# EAGLE design Compressor (EAGLE 8.2.2)
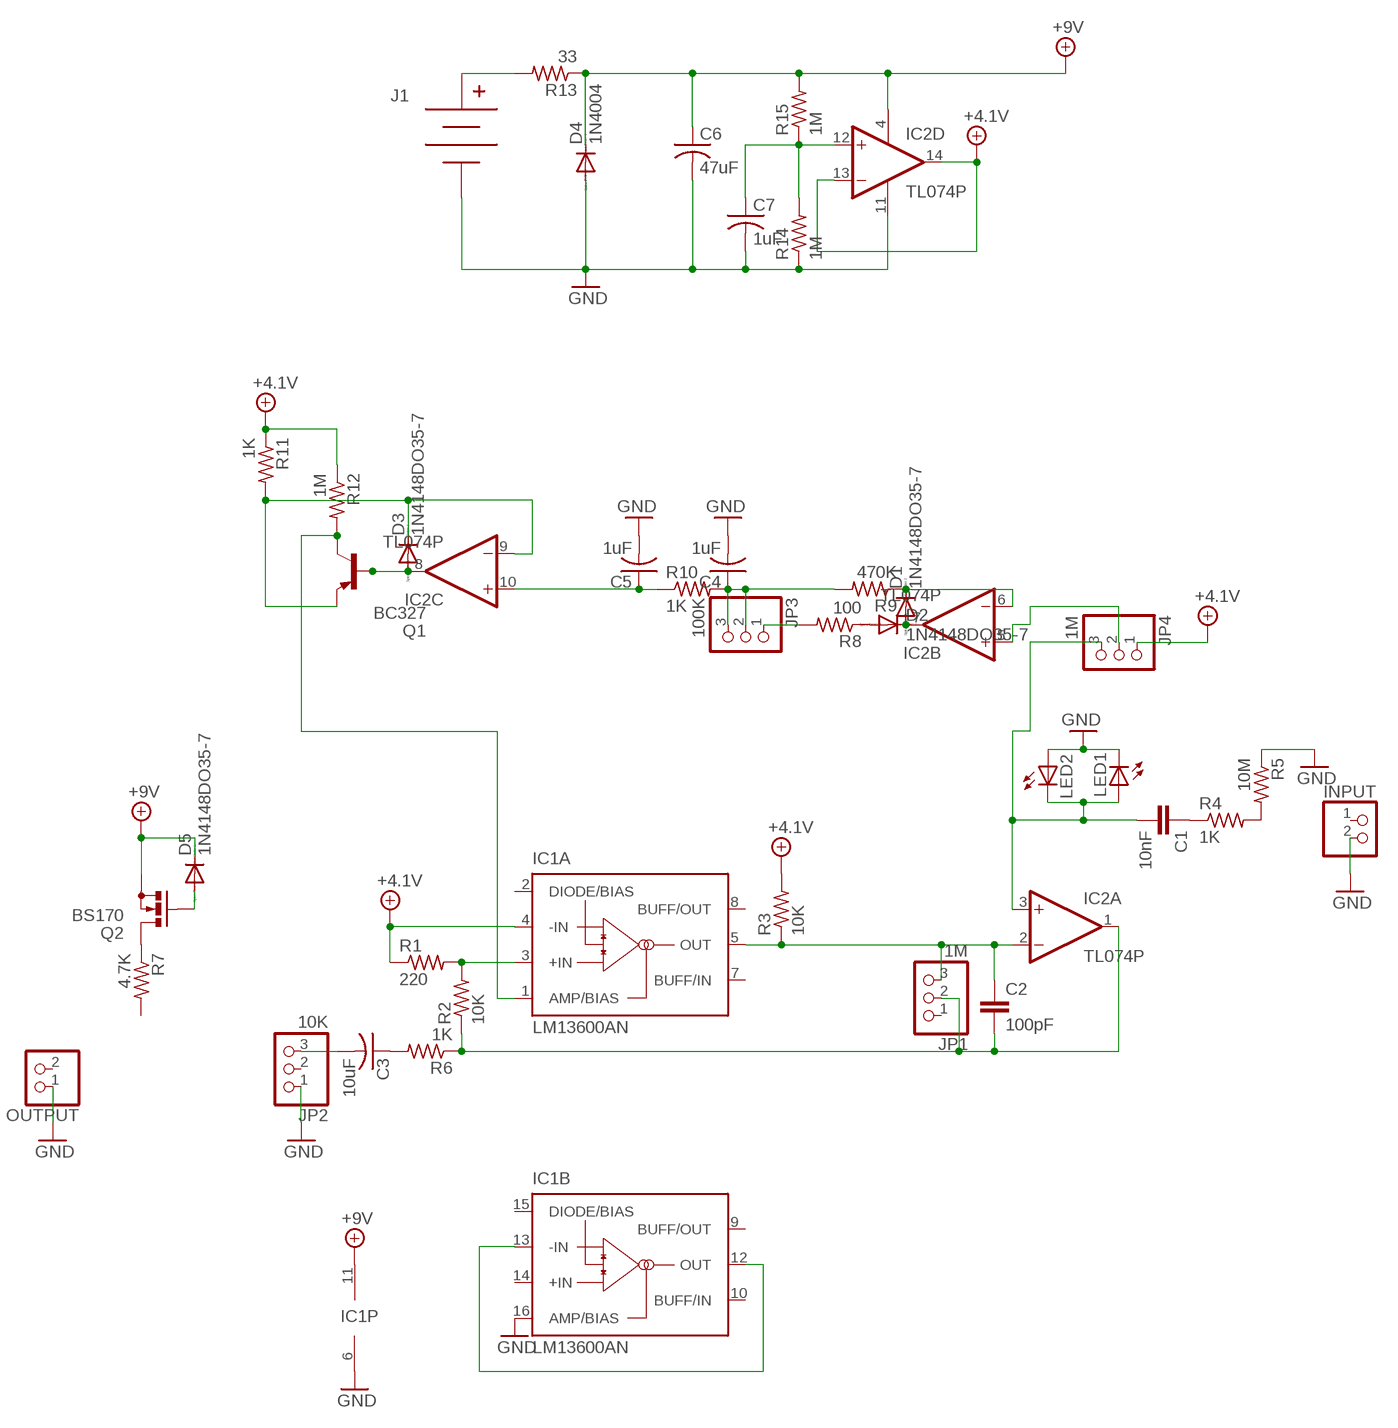
[diagram p0: schematic, sheet 1]

## Parts
C1  10nF  C-EU025-030X050  [C025-030X050]
C2  100pF  C-EU025-030X050  [C025-030X050]
C3  10uF  C-US025-040X050  [C025-040X050]
C4  1uF  C-US025-040X050  [C025-040X050]
C5  1uF  C-US025-040X050  [C025-040X050]
C6  47uF  C-US025-040X050  [C025-040X050]
C7  1uF  C-US025-040X050  [C025-040X050]
D1  1N4148DO35-7  [DO35-7]
D2  1N4148DO35-7  [DO35-7]
D3  1N4148DO35-7  [DO35-7]
D4  1N4004  [DO41-10]
D5  1N4148DO35-7  [DO35-7]
IC1  LM13600AN  [DIL16]
IC2  TL074P  [DIL14]
INPUT  PINHD-1X2  [1X02]
J1  BC9VPC  [BC9VPC]
JP1  1M  PINHD-1X3  [1X03]
JP2  10K  PINHD-1X3  [1X03]
JP3  100K  PINHD-1X3  [1X03]
JP4  1M  PINHD-1X3  [1X03]
LED1  LEDLZR181  [LZR181]
LED2  LEDLZR181  [LZR181]
OUTPUT  PINHD-1X2  [1X02]
Q1  BC327  [TO92]
Q2  BS170  [SOT54E]
R1  220  R-US_0207/7  [0207/7]
R2  10K  R-US_0207/7  [0207/7]
R3  10K  R-US_0207/7  [0207/7]
R4  1K  R-US_0207/7  [0207/7]
R5  10M  R-US_0207/7  [0207/7]
R6  1K  R-US_0207/7  [0207/7]
R7  4.7K  R-US_0207/7  [0207/7]
R8  100  R-US_0207/7  [0207/7]
R9  470K  R-US_0207/7  [0207/7]
R10  1K  R-US_0207/7  [0207/7]
R11  1K  R-US_0207/7  [0207/7]
R12  1M  R-US_0207/7  [0207/7]
R13  33  R-US_0207/7  [0207/7]
R14  1M  R-US_0207/7  [0207/7]
R15  1M  R-US_0207/7  [0207/7]

## Nets
+4.1V: IC1.4(A:-IN) IC2.13(D:-IN) IC2.14(D:OUT) JP4.1 R1.1 R3.2 R11.1 R12.1
+9V: C6.1 D4.C D5.C IC1.11(P:V+) IC2.4(P:V+) Q2.S R13.1 R15.2
GND: C4.2 C5.2 C6.2 C7.2 D4.A IC1.6(P:V-) IC1.16(B:AMP/BIAS) IC2.11(P:V-) INPUT.2 J1.V- JP2.1 LED1.K(C) LED2.A OUTPUT.1 R5.1 R14.1
N$1: IC1.3(A:+IN) R1.2 R2.2
N$2: IC1.12(B:OUT) IC1.13(B:-IN)
N$3: C2.1 IC1.5(A:OUT) IC2.2(A:-IN) JP1.3 R3.1
N$4: D1.A D2.C IC2.7(B:OUT)
N$5: C1.1 R4.1
N$6: R4.2 R5.2
N$7: C1.2 IC2.3(A:+IN) JP4.3 LED1.A LED2.K(C)
N$8: D1.C IC2.6(B:-IN) R9.1
N$9: C2.2 IC2.1(A:OUT) JP1.2 R2.1 R6.1
N$10: C3.1 R6.2
N$11: C3.2 JP2.3
N$12: D2.A R8.1
N$13: JP3.1 R8.2
N$14: C4.1 JP3.2 JP3.3 R9.2 R10.2
N$15: C7.1 IC2.12(D:+IN) R14.2 R15.1
N$16: C5.1 IC2.10(C:+IN) R10.1
N$17: D3.A IC2.8(C:OUT) Q1.2(B)
N$18: D3.C IC2.9(C:-IN) Q1.1(E) R11.2
N$19: J1.V+ R13.2
N$20: IC1.1(A:AMP/BIAS) Q1.3(C) R12.2
N$21: D5.A Q2.G
N$22: Q2.D R7.1
N$24: IC2.5(B:+IN) JP4.2
Unconnected: IC1.2(A:DIODE/BIAS) IC1.7(A:BUFF/IN) IC1.8(A:BUFF/OUT) IC1.9(B:BUFF/OUT) IC1.10(B:BUFF/IN) IC1.14(B:+IN) IC1.15(B:DIODE/BIAS) INPUT.1 JP1.1 JP2.2 OUTPUT.2 R7.2

## Library data of the parts
C1 C2 = resistor:C-EU: CAPACITOR, European symbol
C3-C7 = rcl:C-US: CAPACITOR, American symbol
D1-D3 D5 = diode:1N4148: DIODE high speed (Philips)
D4 = diode:1N4004: DIODE general purpose rectifier, 1 A
IC1 = national-semiconductor:LM13600: Dual Operational Transconductance Amplifiers with Linearizing Diodes and Buffers Source: lm13600.PDF
IC2 = linear:TL074: OP AMP
INPUT OUTPUT = pinhead:PINHD-1X2: PIN HEADER
J1 = SparkFun-Connectors:BC9VPC: 9V Battery Holder - PC Mount Standard and Kit footprints included SparkFun Products: SparkFun SparkPunk Sound Kit <https://www.sparkfun.com/products/11177> SparkFun SparkPunk Sequencer Kit <https://www.sparkfun.com/products/12707>; PROD_ID: BATT-10855
JP1-JP4 = pinhead:PINHD-1X3: PIN HEADER
LED1 LED2 = led:LED: LED OSRAM: - CHIPLED LG R971, LG N971, LY N971, LG Q971, LY Q971, LO R971, LY R971 LH N974, LH R974 LS Q976, LO Q976, LY Q976 LO Q996 - Hyper CHIPLED LW Q18S LB Q993, LB Q99A, LB R99A - SideLED LS A670, LO A670, LY A670, LG A670, LP A670 LB A673, LV A673, LT A673, LW A673 LH A674 LY A675 LS A676, LA A676, LO A676, LY A676, LW A676 LS A679, LY A679, LG A679 - Hyper Micro SIDELED® LS Y876, LA Y876, LO Y876, LY Y876 LT Y87S - SmartLED LW L88C, LW L88S LB L89C, LB L89S, LG L890 LS L89K, LO L89K, LY L89K LS L896, LA L896, LO L896, LY L896 - TOPLED LS T670, LO T670, LY T670, LG T670, LP T670 LSG T670, LSP T670, LSY T670, LOP T670, LYG T670 LG T671, LOG T671, LSG T671 LB T673, LV T673, LT T673, LW T673 LH T674 LS T676, LA T676, LO T676, LY T676, LB T676, LH T676, LSB T676, LW T676 LB T67C, LV T67C, LT T67C, LS T67K, LO T67K, LY T67K, LW E67C LS E67B, LA E67B, LO E67B, LY E67B, LB E67C, LV E67C, LT E67C LW T67C LS T679, LY T679, LG T679 LS T770, LO T770, LY T770, LG T770, LP T770 LB T773, LV T773, LT T773, LW T773 LH T774 LS E675, LA E675, LY E675, LS T675 LS T776, LA T776, LO T776, LY T776, LB T776 LHGB T686 LT T68C, LB T68C - Hyper Mini TOPLED® LB M676 - Mini TOPLED Santana® LG M470 LS M47K, LO M47K, LY M47K Source: http://www.osram.convergy.de LUXEON: - LUMILED® LXK2-PW12-R00, LXK2-PW12-S00, LXK2-PW14-U00, LXK2-PW14-V00 LXK2-PM12-R00, LXK2-PM12-S00, LXK2-PM14-U00 LXK2-PE12-Q00, LXK2-PE12-R00, LXK2-PE12-S00, LXK2-PE14-T00, LXK2-PE14-U00 LXK2-PB12-K00, LXK2-PB12-L00, LXK2-PB12-M00, LXK2-PB14-N00, LXK2-PB14-P00, LXK2-PB14-Q00 LXK2-PR12-L00, LXK2-PR12-M00, LXK2-PR14-Q00, LXK2-PR14-R00 LXK2-PD12-Q00, LXK2-PD12-R00, LXK2-PD12-S00 LXK2-PH12-R00, LXK2-PH12-S00 LXK2-PL12-P00, LXK2-PL12-Q00, LXK2-PL12-R00 Source: www.luxeon.com KINGBRIGHT: KA-3528ASYC Source: www.kingbright.com
Q1 = transistor-pnp:BC327: PNP Transistor
Q2 = transistor-small-signal:BS170: N-CHANNEL MOS FET
R1-R15 = rcl:R-US_: RESISTOR, American symbol

## Board
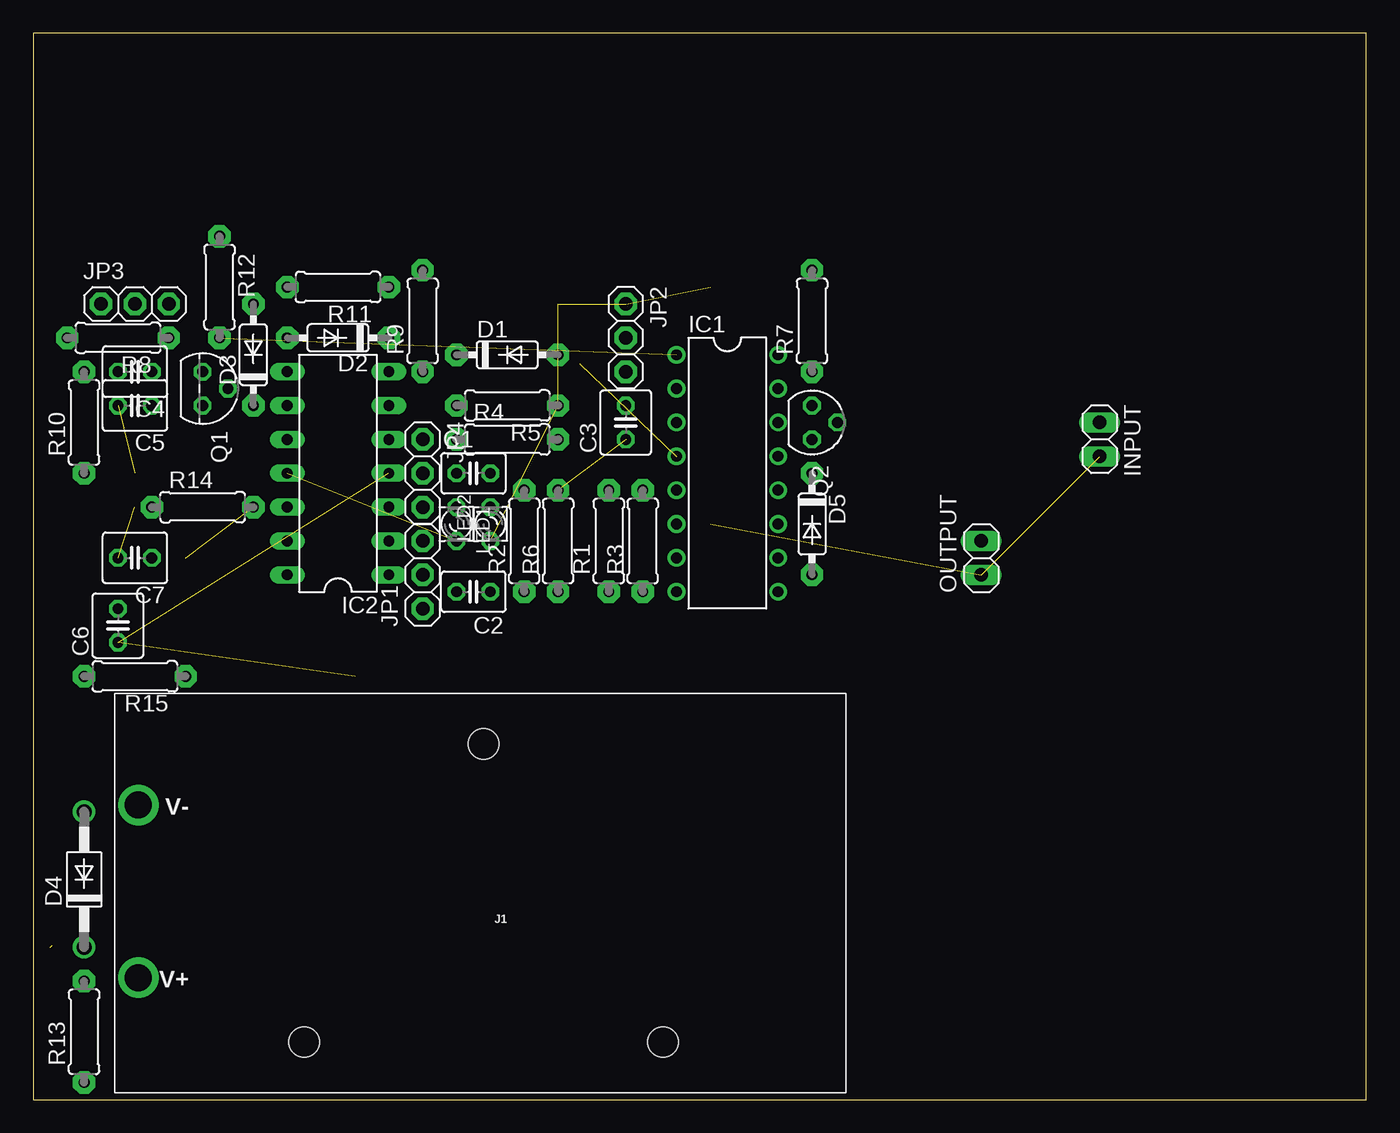
[diagram p1: board, top side]
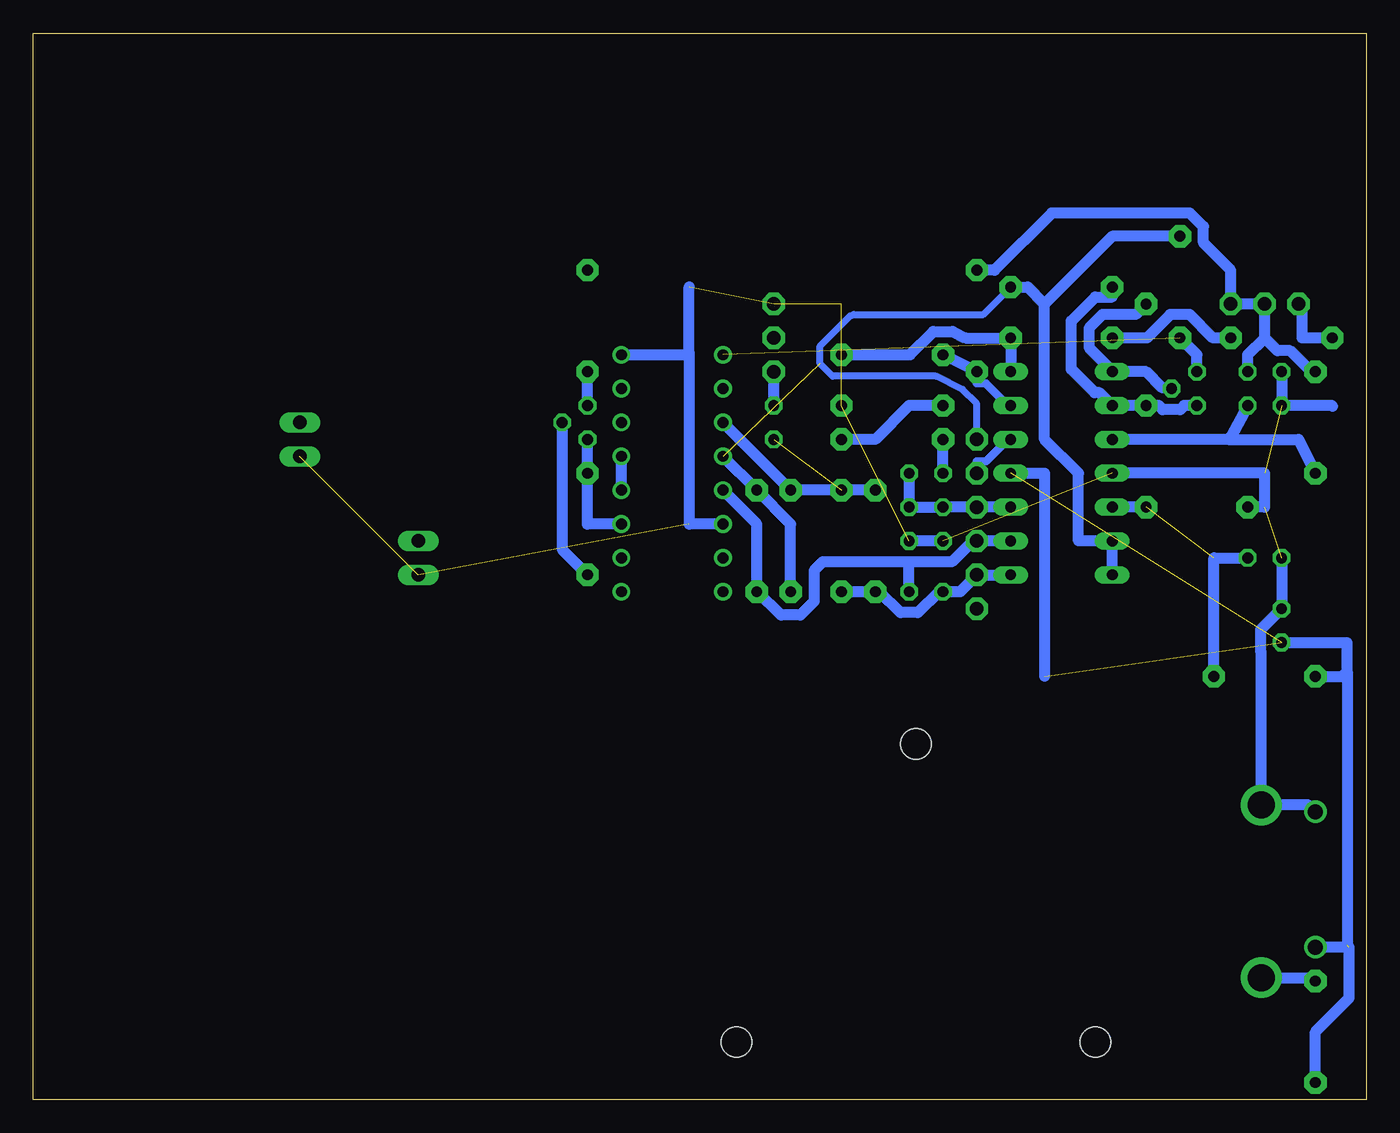
[diagram p2: board, bottom side, seen from below]

Size 100 x 80 mm. Coordinates in mm from the lower left corner, seen from the top.
Outline: 0,0 100,0 100,80 0,80 0,0
Copper layers (1*16): Top 0.035mm / dielectric 1.5mm / Bottom 0.035mm
Design rules "default *": minimum track width 6mil, minimum drill 0.35mm, track to track 20mil, track to pad 20mil, pad to pad 20mil, via to via 20mil, smd to smd 20mil, copper to edge 40mil, drill to drill 6mil, minimum pad ring 10mil, minimum via ring 8mil, stop-mask expansion 4mil, vias tented up to drill 0mil, thermal gap 10mil

### Footprints (pad centres in the part's own frame; a part is rotated, then mirrored left to right if it is on the bottom)
C025-030X050 = drill 0.813 octagon: 1 -1.27,0; 2 1.27,0
C025-040X050 = drill 0.813 octagon: 1 -1.27,0; 2 1.27,0
DO35-7 = drill 0.813 pad 1.676 octagon: A 3.81,0; C -3.81,0
DO41-10 = drill 1.118: A 5.08,0; C -5.08,0
DIL16 = drill 0.813 pad 1.27: 1 -8.89,-3.81; 2 -6.35,-3.81; 3 -3.81,-3.81; 4 -1.27,-3.81; 5 1.27,-3.81; 6 3.81,-3.81; 7 6.35,-3.81; 8 8.89,-3.81; 9 8.89,3.81; 10 6.35,3.81; 11 3.81,3.81; 12 1.27,3.81; 13 -1.27,3.81; 14 -3.81,3.81; 15 -6.35,3.81; 16 -8.89,3.81
DIL14 = drill 0.813 long: 1 -7.62,-3.81; 2 -5.08,-3.81; 3 -2.54,-3.81; 4 0,-3.81; 5 2.54,-3.81; 6 5.08,-3.81; 7 7.62,-3.81; 8 7.62,3.81; 9 5.08,3.81; 10 2.54,3.81; 11 0,3.81; 12 -2.54,3.81; 13 -5.08,3.81; 14 -7.62,3.81
1X02 = drill 1.016 long: 1 -1.27,0; 2 1.27,0
BC9VPC = drill 2.032: V+ 53.086,21.336; V- 53.086,8.382 | hole 2.286: 27.178,3.81; 13.716,26.162; 40.64,26.162
1X03 = drill 1.016 pad 1.676 octagon: 1 -2.54,0; 2 0,0; 3 2.54,0
LZR181 = drill 0.813 octagon: A -1.27,0; K 1.27,0
TO92 = drill 0.813 octagon: 1 1.27,0; 2 0,1.905; 3 -1.27,0
SOT54E = drill 0.813 octagon: D -1.27,0; G 0,1.905; S 1.27,0
0207/7 = drill 0.813 pad 1.676 octagon: 1 -3.81,0; 2 3.81,0

### Placement (x,y rotation side)
C1  33.02,46.99 0 top
C2  33.02,38.1 180 top
C3  44.45,50.8 90 top
C4  7.62,54.61 180 top
C5  7.62,52.07 180 top
C6  6.35,35.56 90 top
C7  7.62,40.64 180 top
D1  35.56,55.88 0 top
D2  22.86,57.15 180 top
D3  16.51,55.88 90 top
D4  3.81,16.51 90 top
D5  58.42,43.18 270 top
IC1  52.07,46.99 270 top
IC2  22.86,46.99 90 top
INPUT  80.01,49.53 270 top
J1  60.96,30.48 180 top
JP1  29.21,39.37 90 top
JP2  44.45,57.15 270 top
JP3  7.62,59.69 0 top
JP4  29.21,46.99 270 top
LED1  31.75,43.18 270 top
LED2  34.29,43.18 90 top
OUTPUT  71.12,40.64 90 top
Q1  12.7,53.34 270 top
Q2  58.42,50.8 270 top
R1  43.18,41.91 90 top
R2  36.83,41.91 90 top
R3  45.72,41.91 90 top
R4  35.56,49.53 0 top
R5  35.56,52.07 180 top
R6  39.37,41.91 90 top
R7  58.42,58.42 90 top
R8  6.35,57.15 180 top
R9  29.21,58.42 90 top
R10  3.81,50.8 90 top
R11  22.86,60.96 180 top
R12  13.97,60.96 270 top
R13  3.81,5.08 90 top
R14  12.7,44.45 0 top
R15  7.62,31.75 180 top

### Tracks (layer width: path | path; a pad name or v marks a point on that pad's centre or on a via)
+4.1V  (1 unrouted)
  Bottom 0.508: JP4.1 29.21,52.21 30.28,53.28 32.28,54.28 40.03,54.28 40.97,55.22 40.97,56.54 38.71,58.8 38.43,58.89 28.74,58.89 R11.1
  Bottom 0.813: 24.13,59.69 25.4,60.96 R11.1 | IC2.14 IC2.13 21.59,41.91 21.59,46.99 24.13,49.53 24.13,59.69 | R12.1 19.05,64.77 24.13,59.69 | R1.1 43.18,43.18 R3.2 IC1.4
+9V  (3 unrouted)
  Bottom 0.813: R13.1 3.81,5.08 1.27,7.62 1.27,11.43 D4.C | C6.1 1.42,34.29 1.42,32.13 | 1.42,32.13 1.42,11.58 | R15.2 1.8,31.75 1.42,32.13 | IC1.11 58.42,43.18 D5.C Q2.S | IC2.4 24.13,46.99 24.13,31.75
GND  (9 unrouted)
  Bottom 0.813: D4.A 4.32,22.1 J1.V- 7.87,33.59 7.92,33.64 7.92,35.26 C6.2 C7.2 | LED1.K LED2.A | C4.2 C5.2 2.6,52.07 2.54,52.01 | R14.1 7.62,44.45 7.62,46.99 IC2.11 | IC1.6 50.8,43.18 50.8,56.02 | 50.8,56.02 50.8,60.96 | IC1.16 50.95,55.88 50.8,56.02
N$1
  Bottom 0.813: R2.2 R1.2 IC1.3
N$2
  Bottom 0.813: IC1.12 IC1.13
N$3
  Bottom 0.813: IC2.2 JP1.3 29.52,41.91 31.1,40.34 34.11,40.34 | C2.1 34.29,40.15 34.11,40.34 | IC1.5 45.72,43.18 R3.1 45.66,38.1 43.91,36.35 42.45,36.35 41.43,37.37 41.43,39.69 40.78,40.34 34.11,40.34
N$4
  Bottom 0.813: IC2.7 D2.C 30.06,57.15 31.02,57.63 32.48,57.63 34.23,55.88 D1.A
N$5
  Bottom 0.813: C1.1 R4.1
N$6
  Bottom 0.813: R5.2 34.29,52.07 36.83,49.53 R4.2
N$7
  Bottom 0.813: IC2.3 JP4.3 LED1.A LED2.K C1.2
N$8
  Bottom 0.61: IC2.6 26.88,52.07 28.53,53.72 29.21,53.72 R9.1
  Bottom 0.813: R9.1 D1.C
N$9
  Bottom 0.813: IC2.1 JP1.2 30.48,38.1 C2.2 32.06,38.1 33.64,36.52 34.94,36.52 36.52,38.1 R2.1 R6.1
N$10  (1 unrouted)
N$11
  Bottom 0.813: C3.2 JP2.3
N$12
  Bottom 0.813: D2.A 16.45,57.15 14.7,58.9 13.24,58.9 11.49,57.15 R8.1
N$13
  Bottom 0.813: R8.2 4.79,57.15 4.79,59.41 JP3.1
N$14
  Bottom 0.813: 7.62,57.15 7.7,57.07 | 7.62,57.15 JP3.2 JP3.3 10.16,62.23 12.22,64.29 12.22,65.5 13.24,66.52 23.59,66.52 27.88,62.23 R9.2 | 7.62,57.15 6.66,56.19 5.7,56.19 4.12,54.61 R10.2 | C4.1 8.89,55.88 7.62,57.15
N$15  (1 unrouted)
  Bottom 0.813: C7.1 11.43,40.64 R15.1 | R14.2 IC2.12
N$16
  Bottom 0.813: 10.35,49.53 IC2.10 | 10.35,49.53 5.08,49.53 R10.1 | C5.1 10.16,49.72 10.35,49.53
N$17
  Bottom 0.813: D3.A 17.3,58.9 19.78,58.9 20.8,57.88 20.8,56.42 19.05,54.67 IC2.8 16.51,54.61 15.29,53.39 15.02,53.39 14.96,53.34 Q1.2
N$18
  Bottom 0.813: Q1.1 13.65,52.07 13.95,51.77 15.26,51.77 15.56,52.07 D3.C IC2.9 20.02,53.03 20.36,53.03 22.12,54.8 22.12,58.42 20.32,60.22 19.05,60.22 R11.2
N$19
  Bottom 0.813: J1.V+ 4.06,9.14 R13.2
N$20  (1 unrouted)
  Bottom 0.813: Q1.3 12.7,55.88 R12.2
N$21
  Bottom 0.813: Q2.G 60.33,41.27 D5.A
N$22
  Bottom 0.813: Q2.D R7.1
N$24
  Bottom 0.61: IC2.5 26.88,49.53 28.53,47.88 29.21,47.88 JP4.2